# Altium project Task_2.PrjPcb (part 3 of 5)
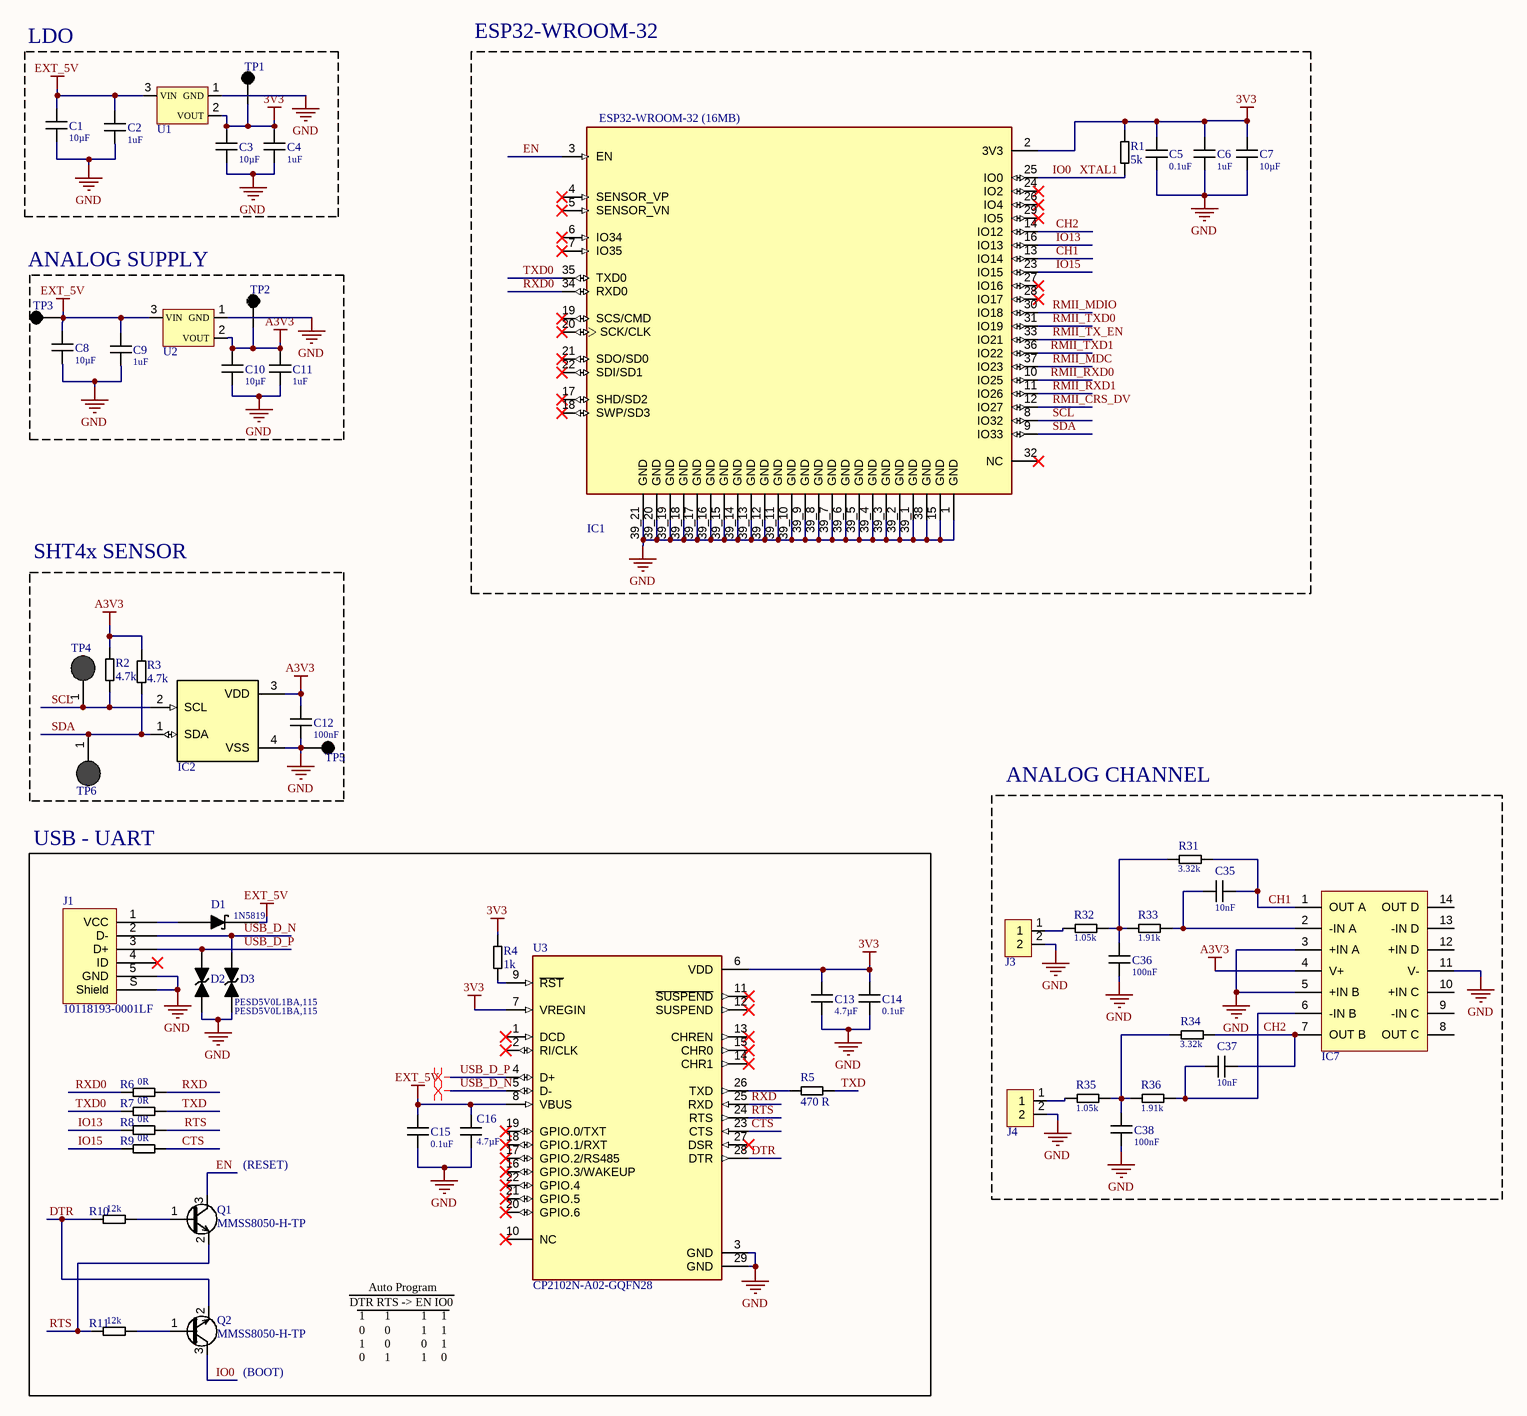
[diagram p3: Sheet1.SchDoc]

## Sheet Sheet1.SchDoc (continued)

### Library data of the parts (continued)
J3 J4 = T-Block 2 Pos: Series 1377 - 5.00 mm Horizontal Entry with Pressure Clamp WR-TBL, 2 pin; Manufacturer: Wurth Electronics; Plating: Copper Alloy,ZINC PLATED; Number of Levels: 1; Number of Positions Per Level: 2; Current: 16A; Voltage: 300V; Number of Contacts: 2NUMBER; Wire Gauge (Max): 30AWG; Wire Gauge (Min): 12AWG; Supplier: Digi-Key; Supplier Part Number: 732-10955-ND; Manufacturer Part Number: 691137710002; RoHS: Yes; Category: Terminal Blocks; Stock: 9094; Pricing: 1=0,41, 10=0,363, 50=0,32, 100=0,287, 500=0,277 (USD); Mounting Technology: Through Hole; Pins: 2NUMBER; Color: Green; Housing Material: PC; Contact Material: 153,154ConductorMaterial; Min Operating Temperature: -30°C; Max Operating Temperature: 120°C; Termination: Screw; Series: WR-TBL Series 1377; Current Rating: 16A; Number of Rows: 1NUMBER; Voltage Rating: 300V; Height: 11.6mm; Lead Pitch: 5mm; RoHS Compliant: Yes; ComponentLink1URL: https://katalog.we-online.de/em/datasheet/691137710002.pdf?src-supplier=Digi-Key; ComponentLink1Description: https://katalog.we-online.de/em/datasheet/691137710002.pdf?src-supplier=Digi-Key
Q1 Q2 = MMSS8050-H-TP: 25V 625mW 120@100mA, 1V 1.5A NPN SOT-23(TO-236) Bipolar Transistors - BJT ROHS; Manufacturer: MCC; Collector Base Voltage (VCBO): 40V; Collector Emitter Saturation Voltage: 500mV; Element Configuration: Single; Emitter Base Voltage (VEBO): 5V; Gain Bandwidth Product: 100MHz; hFE Min: 200; Max Power Dissipation: 300mW; Number of Elements: 1; Supplier 1: Farnell; Manufacturer Part Number: MMSS8050-H-TP; RoHS: Compliant; Category: BJTs; Stock 1: 5298; Pricing 1: 5=0,137, 10=0,081, 100=0,0507, 500=0,0361, 1000=0,0322, 5000=0,0254 (EUR); Case/Package: SOT-23; China RoHS: Compliant; Collector Emitter Breakdown Voltage: 25V; Collector Emitter Voltage (VCEO): 25V; Lead Free: Lead Free; Lifecycle Status: Production; Max Breakdown Voltage: 25V; Max Collector Current: 1.5A; Max Operating Temperature: 150°C; Min Operating Temperature: -55°C; Mount: Surface Mount; Number of Pins: 3; Number of Terminals: 3; Packaging: Tape & Reel (TR); Polarity: NPN; REACH SVHC: Yes; Schedule B: 8541210080, 8541210080|8541210080|8541210080|8541210080|8541210080|8541210080|8541210080|8541210080|8541210080|8541210080|8541210080|8541210080|8541210080|8541210080|8541210080|8541210080|8541210080|8541210080|8541210080|8541210080|8541210080|8541210080|8541210080|85; Transition Frequency: 100MHz; ComponentLink1URL: https://datasheet.octopart.com:443/MMSS8050-H-TP-MCC-datasheet-134701123.pdf?src-supplier=TME; ComponentLink1Description: https://datasheet.octopart.com:443/MMSS8050-H-TP-MCC-datasheet-134701123.pdf?src-supplier=TME; ComponentLink2URL: https://datasheet.octopart.com:443/MMSS8050-H-TP-MCC-datasheet-134581198.pdf?src-supplier=Future+Electronics; ComponentLink2Description: https://datasheet.octopart.com:443/MMSS8050-H-TP-MCC-datasheet-134581198.pdf?src-supplier=Future+Electronics; ComponentLink3URL: https://datasheet.octopart.com:443/MMSS8050-H-TP-MCC-datasheet-27626576.pdf?src-supplier=Future+Electronics; ComponentLink3Description: https://datasheet.octopart.com:443/MMSS8050-H-TP-MCC-datasheet-27626576.pdf?src-supplier=Future+Electronics; Supplier Part Number 1: 4627899
R1 = RES 5k OHM 0603: Res 5k Ohm %0.1 SMD 0603; Manufacturer: Yageo; Tolerance: 0.1%; Max Power Dissipation: 100mW; Temperature Coefficient: 50ppm/°C; Supplier: Digi-Key; Supplier Part Number: 13-RT0603BRE075KLCT-ND; Manufacturer Part Number: RT0603BRE075KL; RoHS: Yes; Category: Chip SMD Resistors; Stock: 19208; Pricing: 1=0,39, 10=0,278, 50=0,1514, 100=0,1111, 500=0,07566, 1000=0,05474 (USD); Case/Package: 0603; Min Operating Temperature: -55°C; Max Operating Temperature: 155°C; Packaging: Tape and Reel; Number of Terminations: 2; Series: RT; ComponentLink1URL: http://www.yageo.com/documents/recent/PYu-RT_1-to-0.01_RoHS_L_9.pdf?src-supplier=Digi-Key; ComponentLink1Description: http://www.yageo.com/documents/recent/PYu-RT_1-to-0.01_RoHS_L_9.pdf?src-supplier=Digi-Key
R2 R3 = RES 4.7k OHM 0805: SMD Chip Resistor, 4.7 kohm, ï¿½ 1%, 125 mW, 0805 [2012 Metric], Thick Film, General Purpose; Manufacturer: Vishay; Voltage Rating: 150V; Power Rating: 125mW; Temperature Coefficient: 100ppm/°C; Supplier 1: Farnell; Manufacturer Part Number: CRCW08054K70FKEA; RoHS: Yes; Category: Chip SMD Resistors; Stock 1: 597720; Pricing 1: 10=0,0285, 100=0,0199, 500=0,0155, 1000=0,0142, 2500=0,0132, 5000=0,0085 (EUR); Case/Package: 0805; Weight: 0.000194oz; Case Code (Imperial): 0805; Case Code (Metric): 2012; Contact Plating: Tin; Size Code: 0805; Min Operating Temperature: -55°C; Max Operating Temperature: 155°C; Tolerance: 1%; Packaging: Tape and Reel; Package Quantity: 10; Resistor Type: Thick Film; Number of Terminations: 2; Termination: SMD/SMT; Max Power Dissipation: 125mW; Voltage Rating (DC): 150V; Features: Automotive AEC-Q200; Series: CRCW; Resistance Tolerance: 1%; Technology: THICK FILM; Construction: Rectangular; Length: 2mm; Width: 0.049inch; Height: 0.45mm; Depth: 1.25mm; Radiation Hardening: No; Lead Free: Lead Free; Military Standard: Not; RoHS Compliant: Yes; Reach SVHC Compliant: Unknown; ComponentLink1URL: https://datasheet.ciiva.com/11808/0900766b80d98b26-11808992.pdf?src-supplier=Rs; ComponentLink1Description: https://datasheet.ciiva.com/11808/0900766b80d98b26-11808992.pdf?src-supplier=Rs; ComponentLink2URL: https://datasheet.ciiva.com/2467/dcrcwe3-2467438.pdf?src-supplier=Digikey; ComponentLink2Description: https://datasheet.ciiva.com/2467/dcrcwe3-2467438.pdf?src-supplier=Digikey; ComponentLink3URL: https://datasheet.ciiva.com/2467/dcrcwe3-2467439.pdf?src-supplier=Digikey; ComponentLink3Description: https://datasheet.ciiva.com/2467/dcrcwe3-2467439.pdf?src-supplier=Digikey; ComponentLink4URL: https://datasheet.ciiva.com/2467/dcrcwe3-2467437.pdf?src-supplier=Digikey; ComponentLink4Description: https://datasheet.ciiva.com/2467/dcrcwe3-2467437.pdf?src-supplier=Digikey; ComponentLink5URL: https://datasheet.ciiva.com/5550/dcrcwe3-109170-5550903.pdf?src-supplier=Mouser; ComponentLink5Description: https://datasheet.ciiva.com/5550/dcrcwe3-109170-5550903.pdf?src-supplier=Mouser; ComponentLink6URL: https://datasheet.ciiva.com/16213/dcrcwe3-16213733.pdf?src-supplier=Future+Electronics; ComponentLink6Description: https://datasheet.ciiva.com/16213/dcrcwe3-16213733.pdf?src-supplier=Future+Electronics; Supplier Part Number 1: 1469923
R4 = RES 1K OHM 0603: Res 1 kOhm, ±%1 SMD 0603; Manufacturer: Yageo; Tolerance: 1%; Temperature Coefficient: 100ppm/°C; Power Rating: 100mW; Voltage Rating: 50V; Supplier: Digi-Key; Supplier Part Number: 311-1.00KHRCT-ND; Manufacturer Part Number: RC0603FR-071KL; RoHS: Yes; Category: Chip SMD Resistors; Stock: 17822876; Pricing: 1=0,1, 10=0,019, 50=0,0112, 100=0,0093, 500=0,00622, 1000=0,00532 (USD); Case/Package: 0603; Contact Plating: Tin,Matte; Case Code (Imperial): 0603; Case Code (Metric): 1608; Min Operating Temperature: -55°C; Max Operating Temperature: 155°C; Resistor Type: Thick Film; Packaging: Tape and Reel; Termination: SMD/SMT; Features: Moisture Resistant; Series: RC; Max Power Dissipation: 100mW; Number of Terminations: 2; Technology: THICK FILM; Resistance Tolerance: 1%; Construction: Rectangular; Length: 1.6mm; Height: 0.45mm; Depth: 0.8mm; Reach SVHC Compliant: No; Lead Free: 5697LeadFree; Military Standard: Not; RoHS Compliant: Yes
R5 = RES 470 OHM 0603: Res 470 Ohm % 1 SMD 0603; Manufacturer: Yageo; Supplier: Digi-Key; Supplier Part Number: 13-RC0603FR-10470RLCT-ND; Manufacturer Part Number: RC0603FR-10470RL; RoHS: Yes; Category: Chip SMD Resistors; Stock: 60505; Pricing: 1=0,1, 10=0,018, 50=0,0106, 100=0,0088, 500=0,00592, 1000=0,00505, 5000=0,00363 (USD); ComponentLink1URL: https://datasheet.ciiva.com/12560/rc0603-272842-12560442.pdf?src-supplier=Mouser; ComponentLink1Description: https://datasheet.ciiva.com/12560/rc0603-272842-12560442.pdf?src-supplier=Mouser
R6-R9 = RES 0 OHM 0603: RES SMD 0 OHM JUMPER 1/10W 0603; Manufacturer: Yageo; Designed by: Semih AŞÇI; Tolerance: 1%; Power Rating: 100mW; Voltage Rating (DC): 50V; Temperature Coefficient: 200ppm/°C; Resistance Tolerance: 5%; Supplier 1: Digi-Key; Manufacturer Part Number: RC0603JR-070RL; RoHS: Yes; Category: Chip SMD Resistors; Stock 1: 2727203; Pricing 1: 5000=0,00224, 10000=0,00195, 25000=0,00171, 50000=0,00160 (USD); Case/Package: 0603; Number of Pins: 2; Contact Plating: Tin,Matte; Case Code (Imperial): 0603; Case Code (Metric): 1608; Size Code: 0603; Min Operating Temperature: -55°C; Max Operating Temperature: 155°C; Resistor Type: Thick Film; Packaging: Tape and Reel; Termination: SMD/SMT; Series: RC; Technology: THICK FILM; Package Quantity: 5000; Voltage Rating: 50V; Features: Moisture Resistant; Max Power Dissipation: 100mW; Number of Terminations: 2; Construction: Rectangular; Length: 1.6mm; Width: 0.8mm; Height: 0.45mm; Depth: 0.8mm; Radiation Hardening: No; REACH SVHC: No SVHC; Lead Free: Lead Free; RoHS Compliant: Yes; Military Standard: Not; Supplier Part Number 1: 311-0.0GRTR-ND
R10 R11 = RES 12k OHM 603: Res 12K Ohm %5 SMD 0603; Manufacturer: Yageo; Tolerance: 5%; Temperature Coefficient: 100ppm/°C; Voltage Rating (DC): 50V; Power Rating: 100mW; Supplier: Digi-Key; Supplier Part Number: 311-12KGRCT-ND; Manufacturer Part Number: RC0603JR-0712KL; RoHS: Yes; Category: Chip SMD Resistors; Stock: 414380; Pricing: 1=0,1, 10=0,014, 50=0,0088, 100=0,0073, 500=0,00486, 1000=0,00415 (USD); Case/Package: 0603; Pins: 2; Case Code (Metric): 1608; Case Code (Imperial): 0603; Min Operating Temperature: -55°C; Max Operating Temperature: 155°C; Resistor Type: Thick Film; Packaging: Tape and Reel; Voltage Rating: 50V; Package Quantity: 1; Number of Terminations: 2; Termination: SMD/SMT; Max Power Dissipation: 100mW; Features: Moisture Resistant; Series: RC; Resistance Tolerance: 5%; Length: 0.063inch; Width: 0.031inch; Height: 0.022inch; Reach SVHC Compliant: No; Lead Free: Lead Free; RoHS Compliant: Yes; ComponentLink1URL: https://datasheet.ciiva.com/2452/pyu-r-int-thick-7-2452913.pdf?src-supplier=Digi-Key; ComponentLink1Description: https://datasheet.ciiva.com/2452/pyu-r-int-thick-7-2452913.pdf?src-supplier=Digi-Key; ComponentLink2URL: https://datasheet.ciiva.com/2452/pyu-r-int-thick-7-2452911.pdf?src-supplier=Digi-Key; ComponentLink2Description: https://datasheet.ciiva.com/2452/pyu-r-int-thick-7-2452911.pdf?src-supplier=Digi-Key; ComponentLink3URL: https://datasheet.ciiva.com/2452/pyu-r-int-thick-7-2452912.pdf?src-supplier=Digi-Key; ComponentLink3Description: https://datasheet.ciiva.com/2452/pyu-r-int-thick-7-2452912.pdf?src-supplier=Digi-Key; ComponentLink4URL: https://datasheet.ciiva.com/7746/443971-7746437.pdf?src-supplier=Element14; ComponentLink4Description: https://datasheet.ciiva.com/7746/443971-7746437.pdf?src-supplier=Element14; ComponentLink5URL: https://datasheet.ciiva.com/7746/443971-7746438.pdf?src-supplier=Element14; ComponentLink5Description: https://datasheet.ciiva.com/7746/443971-7746438.pdf?src-supplier=Element14
R31 R34 = RES 3.32k OHM 0603: Res Thin Film 0603 3.32K Ohm 0.1% 0.1W(1/10W) ±25ppm/C Pad SMD Automotive T/R; Manufacturer: Panasonic; Manufacturer Part Number: ERA3AEB3321V; Max Power Dissipation: 100mW; Temperature Coefficient: 25ppm/°C; Voltage Rating: 75V; Supplier 1: Farnell; RoHS: Compliant; Category: Chip SMD Resistors; Stock 1: 5000; Pricing 1: 10=0,203, 100=0,169, 500=0,144, 1000=0,132, 2500=0,12, 5000=0,118 (EUR); Case/Package: 0603; Case Code (Imperial): 0603; Case Code (Metric): 1608; Composition: Metal Film, Thin Film; Contact Plating: Tin; Depth: 800µm; Features: Automotive AEC-Q200; Height: 450µm; Height - Seated (Max): 558.8µm; Lead Free: Lead Free; Length: 1.6mm; Lifecycle Status: Production; Max Operating Temperature: 155°C; Military Standard: Not; Min Operating Temperature: -55°C; Mount: Surface Mount; Number of Pins: 2; Number of Terminals: 2; Number of Terminations: 2; Packaging: Cut Tape; Power Dissipation: 100mW; Power Rating: 100mW; Radiation Hardening: No; REACH SVHC: Yes; Schedule B: 8533210045, 8533210045|8533210045|8533210045|8533210045|8533210045; Termination: SMD/SMT; Tolerance: 0.1%; Voltage Rating (DC): 75V; Width: 800µm; Working Voltage: 75V; ComponentLink1URL: https://datasheet.octopart.com:443/ERA3AEB3321V-Panasonic-datasheet-181959660.pdf?src-supplier=IHS; ComponentLink1Description: https://datasheet.octopart.com:443/ERA3AEB3321V-Panasonic-datasheet-181959660.pdf?src-supplier=IHS; ComponentLink2URL: https://datasheet.octopart.com:443/ERA3AEB3321V-Panasonic-datasheet-62287448.pdf?src-supplier=Newark; ComponentLink2Description: https://datasheet.octopart.com:443/ERA3AEB3321V-Panasonic-datasheet-62287448.pdf?src-supplier=Newark; ComponentLink3URL: https://datasheet.octopart.com:443/ERA3AEB3321V-Panasonic-datasheet-136531316.pdf?src-supplier=Newark; ComponentLink3Description: https://datasheet.octopart.com:443/ERA3AEB3321V-Panasonic-datasheet-136531316.pdf?src-supplier=Newark; ComponentLink4URL: https://datasheet.octopart.com:443/ERA3AEB3321V-Panasonic-datasheet-8367715.pdf?src-supplier=Newark; ComponentLink4Description: https://datasheet.octopart.com:443/ERA3AEB3321V-Panasonic-datasheet-8367715.pdf?src-supplier=Newark; ComponentLink5URL: https://datasheet.octopart.com:443/ERA-3AEB3321V-Panasonic-datasheet-154766165.pdf?src-supplier=Master+Electronics; ComponentLink5Description: https://datasheet.octopart.com:443/ERA-3AEB3321V-Panasonic-datasheet-154766165.pdf?src-supplier=Master+Electronics; ComponentLink6URL: https://datasheet.octopart.com:443/ERA3AEB3321V-Panasonic-datasheet-188913046.pdf?src-supplier=TME; ComponentLink6Description: https://datasheet.octopart.com:443/ERA3AEB3321V-Panasonic-datasheet-188913046.pdf?src-supplier=TME; ComponentLink7URL: https://sigma.octopart.com:443/150570796/technical_drawing/Panasonic-ERA3AEB3321V.pdf?src-supplier=Panasonic+SCT; ComponentLink7Description: https://sigma.octopart.com:443/150570796/technical_drawing/Panasonic-ERA3AEB3321V.pdf?src-supplier=Panasonic+SCT; ComponentLink8URL: https://datasheet.octopart.com:443/ERA3AEB3321V-Panasonic-datasheet-138783076.pdf?src-supplier=Burklin+Elektronik; ComponentLink8Description: https://datasheet.octopart.com:443/ERA3AEB3321V-Panasonic-datasheet-138783076.pdf?src-supplier=Burklin+Elektronik; ComponentLink9URL: https://datasheet.octopart.com/ERA3AEB3321V-Panasonic-datasheet-78375410.pdf; ComponentLink9Description: https://datasheet.octopart.com/ERA3AEB3321V-Panasonic-datasheet-78375410.pdf; ComponentLink10URL: https://datasheet.octopart.com:443/ERA-3AEB3321V-Panasonic-datasheet-62096640.pdf?src-supplier=Future+Electronics; ComponentLink10Description: https://datasheet.octopart.com:443/ERA-3AEB3321V-Panasonic-datasheet-62096640.pdf?src-supplier=Future+Electronics; ComponentLink11URL: https://datasheet.octopart.com:443/ERA3AEB3321V-Panasonic-datasheet-13266200.pdf?src-supplier=Electro+Sonic; ComponentLink11Description: https://datasheet.octopart.com:443/ERA3AEB3321V-Panasonic-datasheet-13266200.pdf?src-supplier=Electro+Sonic; ComponentLink12URL: https://datasheet.octopart.com:443/ERA3AEB3321V-Panasonic-datasheet-33006989.pdf?src-supplier=Electro+Sonic; ComponentLink12Description: https://datasheet.octopart.com:443/ERA3AEB3321V-Panasonic-datasheet-33006989.pdf?src-supplier=Electro+Sonic; ComponentLink13URL: https://datasheet.octopart.com:443/ERA-3AEB3321V-Panasonic-datasheet-46744048.pdf?src-supplier=Electro+Sonic; ComponentLink13Description: https://datasheet.octopart.com:443/ERA-3AEB3321V-Panasonic-datasheet-46744048.pdf?src-supplier=Electro+Sonic; Supplier Part Number 1: 4632580
R32 R35 = RES 1.05k OHM 0603: Res Thin Film 0603 1.05K Ohm 0.1% 0.1W(1/10W) ±25ppm/C Pad SMD Automotive T/R; Manufacturer: Panasonic; Manufacturer Part Number: ERA3AEB1051V; Max Power Dissipation: 100mW; Temperature Coefficient: 25ppm/°C; Voltage Rating: 75V; Supplier 1: Farnell; RoHS: Compliant; Category: Chip SMD Resistors; Stock 1: 4890; Pricing 1: 10=0,203, 100=0,169, 500=0,144, 1000=0,132, 2500=0,12, 5000=0,118 (EUR); Case/Package: 0603; Case Code (Imperial): 0603; Case Code (Metric): 1608; Composition: Metal Film, Thin Film; Contact Plating: Tin; Depth: 800µm; Features: Automotive AEC-Q200; Height: 450µm; Height - Seated (Max): 558.8µm; Lead Free: Lead Free; Length: 1.6mm; Lifecycle Status: Production; Max Operating Temperature: 155°C; Military Standard: Not; Min Operating Temperature: -55°C; Mount: Surface Mount; Number of Pins: 2; Number of Terminals: 2; Number of Terminations: 2; Power Dissipation: 100mW; Power Rating: 100mW; Radiation Hardening: No; REACH SVHC: Yes; Schedule B: 8533210045, 8533210045|8533210045|8533210045|8533210045|8533210045; Tolerance: 0.1%; Voltage Rating (DC): 75V; Width: 800µm; Working Voltage: 75V; ComponentLink1URL: https://datasheet.octopart.com:443/ERA3AEB1051V-Panasonic-datasheet-181959660.pdf?src-supplier=IHS; ComponentLink1Description: https://datasheet.octopart.com:443/ERA3AEB1051V-Panasonic-datasheet-181959660.pdf?src-supplier=IHS; ComponentLink2URL: https://datasheet.octopart.com:443/ERA3AEB1051V-Panasonic-datasheet-62287448.pdf?src-supplier=Future+Electronics; ComponentLink2Description: https://datasheet.octopart.com:443/ERA3AEB1051V-Panasonic-datasheet-62287448.pdf?src-supplier=Future+Electronics; ComponentLink3URL: https://datasheet.octopart.com:443/ERA3AEB1051V-Panasonic-datasheet-136531316.pdf?src-supplier=Newark; ComponentLink3Description: https://datasheet.octopart.com:443/ERA3AEB1051V-Panasonic-datasheet-136531316.pdf?src-supplier=Newark; ComponentLink4URL: https://datasheet.octopart.com:443/ERA3AEB1051V-Panasonic-datasheet-8367715.pdf?src-supplier=Newark; ComponentLink4Description: https://datasheet.octopart.com:443/ERA3AEB1051V-Panasonic-datasheet-8367715.pdf?src-supplier=Newark; ComponentLink5URL: https://datasheet.octopart.com:443/ERA-3AEB1051V-Panasonic-datasheet-154766165.pdf?src-supplier=JRH+Electronics; ComponentLink5Description: https://datasheet.octopart.com:443/ERA-3AEB1051V-Panasonic-datasheet-154766165.pdf?src-supplier=JRH+Electronics; ComponentLink6URL: https://datasheet.octopart.com:443/ERA3AEB1051V-Panasonic-datasheet-188913046.pdf?src-supplier=TME; ComponentLink6Description: https://datasheet.octopart.com:443/ERA3AEB1051V-Panasonic-datasheet-188913046.pdf?src-supplier=TME; ComponentLink7URL: https://sigma.octopart.com:443/150570796/technical_drawing/Panasonic-ERA3AEB1051V.pdf?src-supplier=Panasonic+SCT; ComponentLink7Description: https://sigma.octopart.com:443/150570796/technical_drawing/Panasonic-ERA3AEB1051V.pdf?src-supplier=Panasonic+SCT; ComponentLink8URL: https://datasheet.octopart.com:443/ERA3AEB1051V-Panasonic-datasheet-138783076.pdf?src-supplier=Burklin+Elektronik; ComponentLink8Description: https://datasheet.octopart.com:443/ERA3AEB1051V-Panasonic-datasheet-138783076.pdf?src-supplier=Burklin+Elektronik; ComponentLink9URL: https://datasheet.octopart.com/ERA3AEB1051V-Panasonic-datasheet-78375410.pdf; ComponentLink9Description: https://datasheet.octopart.com/ERA3AEB1051V-Panasonic-datasheet-78375410.pdf; ComponentLink10URL: https://datasheet.octopart.com:443/ERA3AEB1051V-Panasonic---ECG-datasheet-15994758.pdf?src-supplier=Farnell; ComponentLink10Description: https://datasheet.octopart.com:443/ERA3AEB1051V-Panasonic---ECG-datasheet-15994758.pdf?src-supplier=Farnell; ComponentLink11URL: https://datasheet.octopart.com:443/ERA3AEB1051V-Panasonic-datasheet-13266200.pdf?src-supplier=Electro+Sonic; ComponentLink11Description: https://datasheet.octopart.com:443/ERA3AEB1051V-Panasonic-datasheet-13266200.pdf?src-supplier=Electro+Sonic; ComponentLink12URL: https://datasheet.octopart.com:443/ERA-3AEB1051V-Panasonic-datasheet-33006989.pdf?src-supplier=Electro+Sonic; ComponentLink12Description: https://datasheet.octopart.com:443/ERA-3AEB1051V-Panasonic-datasheet-33006989.pdf?src-supplier=Electro+Sonic; ComponentLink13URL: https://datasheet.octopart.com:443/ERA-3AEB1051V-Panasonic-datasheet-46744048.pdf?src-supplier=Electro+Sonic; ComponentLink13Description: https://datasheet.octopart.com:443/ERA-3AEB1051V-Panasonic-datasheet-46744048.pdf?src-supplier=Electro+Sonic; Supplier Part Number 1: 4632600
R33 R36 = RES 1.91k OHM 0603: Res Thin Film 0603 1.91K Ohm 0.1% 0.1W(1/10W) ±25ppm/C Pad SMD Automotive T/R; Manufacturer: Panasonic; Max Power Dissipation: 100mW; Temperature Coefficient: 25ppm/°C; Voltage Rating: 75V; Supplier 1: Mouser; Manufacturer Part Number: ERA-3AEB1911V; RoHS: Compliant; Category: Chip SMD Resistors; Stock 1: 3131; Pricing 1: 1=0,1, 10=0,054, 50=0,054, 100=0,047, 1000=0,043, 10000=0,035 (USD); Case/Package: 0603; Case Code (Imperial): 0603; Case Code (Metric): 1608; Composition: Metal Film, Thin Film; Contact Plating: Tin; Depth: 800µm; Features: Automotive AEC-Q200; Height: 450µm; Lead Free: Lead Free; Length: 1.6mm; Lifecycle Status: Production; Max Operating Temperature: 155°C; Military Standard: Not; Min Operating Temperature: -55°C; Mount: Surface Mount; Number of Pins: 2; Number of Terminals: 2; Number of Terminations: 2; Power Dissipation: 100mW; Power Rating: 100mW; Radiation Hardening: No; REACH SVHC: Yes; Schedule B: 8533210045; Termination: SMD/SMT; Tolerance: 0.1%; Voltage Rating (DC): 75V; Width: 800µm; Working Voltage: 75V; ComponentLink1URL: https://datasheet.octopart.com:443/ERA-3AEB1911V-Panasonic-datasheet-62287448.pdf?src-supplier=element14+APAC; ComponentLink1Description: https://datasheet.octopart.com:443/ERA-3AEB1911V-Panasonic-datasheet-62287448.pdf?src-supplier=element14+APAC; ComponentLink2URL: https://datasheet.octopart.com:443/ERA3AEB1911V-Panasonic-datasheet-136531316.pdf?src-supplier=element14+APAC; ComponentLink2Description: https://datasheet.octopart.com:443/ERA3AEB1911V-Panasonic-datasheet-136531316.pdf?src-supplier=element14+APAC; ComponentLink3URL: https://datasheet.octopart.com:443/ERA-3AEB1911V-Panasonic-datasheet-8367715.pdf?src-supplier=RS+(Formerly+Allied+Electronics); ComponentLink3Description: https://datasheet.octopart.com:443/ERA-3AEB1911V-Panasonic-datasheet-8367715.pdf?src-supplier=RS+(Formerly+Allied+Electronics); ComponentLink4URL: https://datasheet.octopart.com:443/ERA-3AEB1911V-Panasonic-datasheet-154766165.pdf?src-supplier=Master+Electronics; ComponentLink4Description: https://datasheet.octopart.com:443/ERA-3AEB1911V-Panasonic-datasheet-154766165.pdf?src-supplier=Master+Electronics; ComponentLink5URL: https://datasheet.octopart.com:443/ERA-3AEB1911V-Panasonic-datasheet-13266200.pdf?src-supplier=Future+Electronics; ComponentLink5Description: https://datasheet.octopart.com:443/ERA-3AEB1911V-Panasonic-datasheet-13266200.pdf?src-supplier=Future+Electronics; ComponentLink6URL: https://datasheet.octopart.com:443/ERA-3AEB1911V-Panasonic-datasheet-12510007.pdf?src-supplier=Future+Electronics; ComponentLink6Description: https://datasheet.octopart.com:443/ERA-3AEB1911V-Panasonic-datasheet-12510007.pdf?src-supplier=Future+Electronics; ComponentLink7URL: https://datasheet.octopart.com:443/ERA-3AEB1911V-Panasonic-datasheet-11763931.pdf?src-supplier=Future+Electronics; ComponentLink7Description: https://datasheet.octopart.com:443/ERA-3AEB1911V-Panasonic-datasheet-11763931.pdf?src-supplier=Future+Electronics; ComponentLink8URL: https://datasheet.octopart.com:443/ERA-3AEB1911V-Panasonic-datasheet-10840895.pdf?src-supplier=Future+Electronics; ComponentLink8Description: https://datasheet.octopart.com:443/ERA-3AEB1911V-Panasonic-datasheet-10840895.pdf?src-supplier=Future+Electronics; ComponentLink9URL: https://datasheet.octopart.com:443/ERA-3AEB1911V-Panasonic-datasheet-5392808.pdf?src-supplier=Future+Electronics; ComponentLink9Description: https://datasheet.octopart.com:443/ERA-3AEB1911V-Panasonic-datasheet-5392808.pdf?src-supplier=Future+Electronics; ComponentLink10URL: https://datasheet.octopart.com:443/ERA-3AEB1911V-Panasonic-datasheet-61114971.pdf?src-supplier=Future+Electronics; ComponentLink10Description: https://datasheet.octopart.com:443/ERA-3AEB1911V-Panasonic-datasheet-61114971.pdf?src-supplier=Future+Electronics; ComponentLink11URL: https://datasheet.octopart.com:443/ERA3AEB1911V-Panasonic-datasheet-188913046.pdf?src-supplier=TME; ComponentLink11Description: https://datasheet.octopart.com:443/ERA3AEB1911V-Panasonic-datasheet-188913046.pdf?src-supplier=TME; ComponentLink12URL: https://datasheet.octopart.com:443/ERA-3AEB1911V-Panasonic-datasheet-182736486.pdf?src-supplier=JRH+Electronics; ComponentLink12Description: https://datasheet.octopart.com:443/ERA-3AEB1911V-Panasonic-datasheet-182736486.pdf?src-supplier=JRH+Electronics; ComponentLink13URL: https://sigma.octopart.com:443/150570796/technical_drawing/Panasonic-ERA3AEB1911V.pdf?src-supplier=Panasonic+SCT; ComponentLink13Description: https://sigma.octopart.com:443/150570796/technical_drawing/Panasonic-ERA3AEB1911V.pdf?src-supplier=Panasonic+SCT; ComponentLink14URL: https://datasheet.octopart.com:443/ERA3AEB1911V-Panasonic-datasheet-138783076.pdf?src-supplier=Burklin+Elektronik; ComponentLink14Description: https://datasheet.octopart.com:443/ERA3AEB1911V-Panasonic-datasheet-138783076.pdf?src-supplier=Burklin+Elektronik; ComponentLink15URL: https://datasheet.octopart.com/ERA-3AEB1911V-Panasonic-datasheet-78375410.pdf; ComponentLink15Description: https://datasheet.octopart.com/ERA-3AEB1911V-Panasonic-datasheet-78375410.pdf; Supplier Part Number 1: 667-ERA-3AEB1911V
TP1-TP3 TP5 = Test Point: MS27478 - Connectors Receptacle Electrical Solder Mounting Solder Type Hermetic Seal 38999 Series II; Manufacturer: Keystone; Manufacturer Part Number: 5007; Body Material: Bronze, PBT; Hole Diameter: 1.6mm; Inside Diameter: 1.78mm; Insulation: Insulated; Number of Contacts: 1; Outside Diameter: 3.18mm; Plating: Silver; Supplier 1: Farnell; RoHS: Compliant; Category: Connectors; Stock 1: 36826; Pricing 1: 1=0,124, 25=0,118, 50=0,112, 100=0,108, 500=0,103, 1000=0,099 (EUR); Color: White; Contact Material: Bronze; Contact Plating: Tin; Flammability Rating: UL94 V-0; Height: 8.89mm; Housing Color: White; Lead Free: Lead Free; Length: 8.89mm; Lifecycle Status: Production; Material: Bronze, Nylon, Silver; Mount: PCB, Through Hole; Number of Ports: 1; Orientation: Straight; Packaging: Bulk; REACH SVHC: Yes; ComponentLink1URL: https://datasheet.octopart.com:443/5007-Keystone-datasheet-15716159.pdf?src-supplier=IHS; ComponentLink1Description: https://datasheet.octopart.com:443/5007-Keystone-datasheet-15716159.pdf?src-supplier=IHS; ComponentLink2URL: https://datasheet.octopart.com:443/5007-Keystone-datasheet-23674.pdf?src-supplier=element14; ComponentLink2Description: https://datasheet.octopart.com:443/5007-Keystone-datasheet-23674.pdf?src-supplier=element14; ComponentLink3URL: https://datasheet.octopart.com:443/5007-Keystone-datasheet-60278094.pdf?src-supplier=LKR; ComponentLink3Description: https://datasheet.octopart.com:443/5007-Keystone-datasheet-60278094.pdf?src-supplier=LKR; ComponentLink4URL: https://datasheet.octopart.com:443/5007-Keystone-datasheet-9590016.pdf?src-supplier=Sager+Electronics; ComponentLink4Description: https://datasheet.octopart.com:443/5007-Keystone-datasheet-9590016.pdf?src-supplier=Sager+Electronics; ComponentLink5URL: https://datasheet.octopart.com:443/5007-Keystone-datasheet-10925273.pdf?src-supplier=RS+(Formerly+Allied+Electronics); ComponentLink5Description: https://datasheet.octopart.com:443/5007-Keystone-datasheet-10925273.pdf?src-supplier=RS+(Formerly+Allied+Electronics); ComponentLink6URL: https://datasheet.octopart.com:443/5007-Keystone-datasheet-6528.pdf?src-supplier=RS+(Formerly+Allied+Electronics); ComponentLink6Description: https://datasheet.octopart.com:443/5007-Keystone-datasheet-6528.pdf?src-supplier=RS+(Formerly+Allied+Electronics); ComponentLink7URL: https://datasheet.octopart.com:443/5007-Keystone-datasheet-549598.pdf?src-supplier=Future+Electronics; ComponentLink7Description: https://datasheet.octopart.com:443/5007-Keystone-datasheet-549598.pdf?src-supplier=Future+Electronics; ComponentLink8URL: https://datasheet.octopart.com:443/5007-Keystone-datasheet-527775.pdf?src-supplier=Future+Electronics; ComponentLink8Description: https://datasheet.octopart.com:443/5007-Keystone-datasheet-527775.pdf?src-supplier=Future+Electronics; Supplier Part Number 1: 2301285
U1 U2 = AMS1117-3.3V SMD: 3.3V Voltage regulator; Manufacturer: Advanced Monolithic Systems; Designed by: Semih AŞÇI; Manufacturer Part Number: AMS1117-3.3; RoHS Compliant: Yes
U3 = CP2102N-A02-GQFN28: 28-WFQFN Exposed Pad S-XQCC-N28 UART USB 2.0 interface controller 3V~3.6V 5mm 9.5mA 1.5MBps; Manufacturer: Silicon Labs; Manufacturer Lifecycle Status: FULL PRODUCTION; Max Junction Temperature (Tj): 105°C; Max Supply Voltage: 3.6V; Min Supply Voltage: 3V; Number of Digital IO: 7; Number of Ports: 1; Operating Supply Voltage: 3.3V; USB Standard: USB 2.0; Supplier 1: Arrow Electronics; Manufacturer Part Number: CP2102N-A02-GQFN28; RoHS: Compliant; Category: USB Interface ICs; Stock 1: 2256; Pricing 1: 1533=2,031 (USD); Ambient Temperature Range High: 85°C; China RoHS: Compliant; Data Rate: 1.5Mbps; Height: 800µm; Height - Seated (Max): 800µm; Interface: UART; Length: 5mm; Lifecycle Status: Production; Max Operating Temperature: 85°C; Min Operating Temperature: -40°C; Number of Terminals: 28; REACH SVHC: Yes; Terminal Pitch: 500µm; Width: 5mm; ComponentLink1URL: https://datasheet.octopart.com:443/CP2102N-A02-GQFN28-Silicon-Labs-datasheet-138898368.pdf?src-supplier=Augswan; ComponentLink1Description: https://datasheet.octopart.com:443/CP2102N-A02-GQFN28-Silicon-Labs-datasheet-138898368.pdf?src-supplier=Augswan; ComponentLink2URL: https://datasheet.octopart.com:443/CP2102N-A02-GQFN28-Silicon-Labs-datasheet-166051788.pdf?src-supplier=IHS; ComponentLink2Description: https://datasheet.octopart.com:443/CP2102N-A02-GQFN28-Silicon-Labs-datasheet-166051788.pdf?src-supplier=IHS; Supplier Part Number 1: CP2102N-A02-GQFN28

## Sheet ethernet.SchDoc
size 420 x 297 mm; SheetNumber: 2; SheetTotal: 2
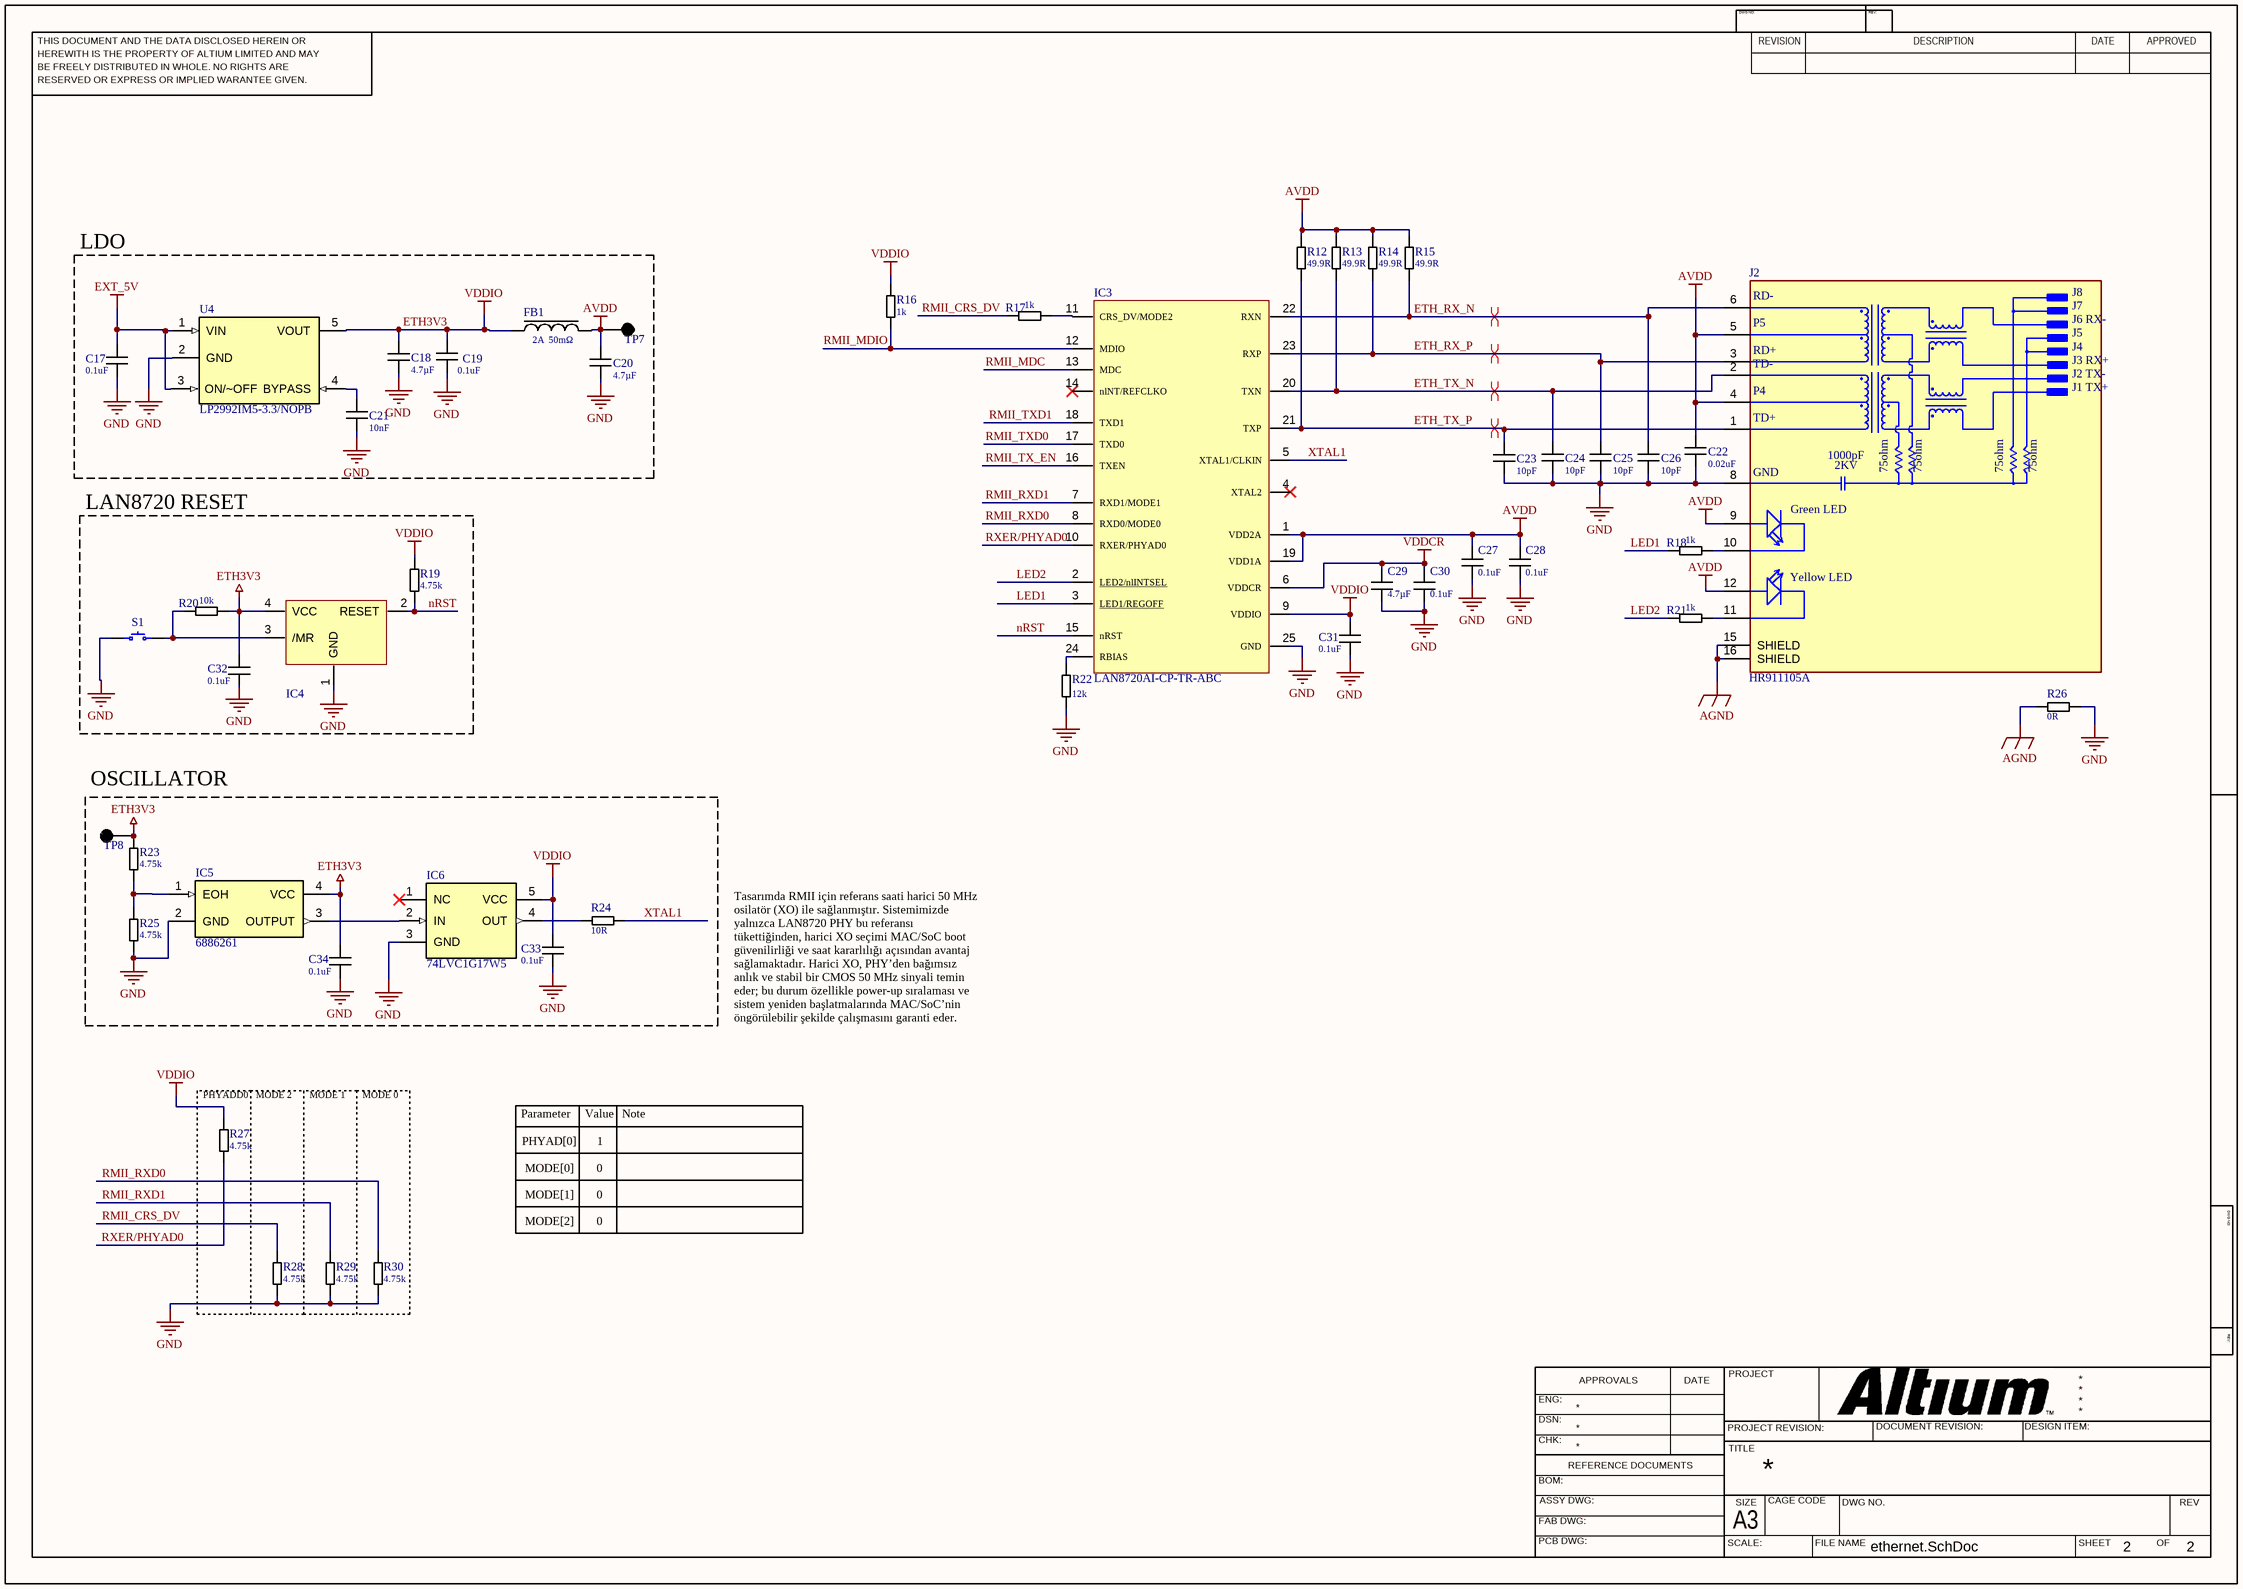
[diagram p1: ethernet.SchDoc]

### Parts
C17  Capacitance: 0.1uF  [CAP_0603]  (hidden comment: C0603C104K8RACTU)
C18  Capacitance: 4.7µF  [CAP_0603]  (hidden comment: CC0603KRX5R6BB475)
C19  Capacitance: 0.1uF  [CAP_0603]  (hidden comment: C0603C104K8RACTU)
C20  Capacitance: 4.7µF  [CAP_0603]  (hidden comment: CC0603KRX5R6BB475)
C21  Capacitance: 10nF  [CAP_0603]  (hidden comment: 06035C103MAZ2A)
C22  Capacitance: 0.02uF  [CAP_0603]  (hidden comment: KGM15AR71A223KT)
C23  Capacitance: 10pF  [CAP_0603]  (hidden comment: CC0603JRNPO9BN100)
C24  Capacitance: 10pF  [CAP_0603]  (hidden comment: CC0603JRNPO9BN100)
C25  Capacitance: 10pF  [CAP_0603]  (hidden comment: CC0603JRNPO9BN100)
C26  Capacitance: 10pF  [CAP_0603]  (hidden comment: CC0603JRNPO9BN100)
C27  Capacitance: 0.1uF  [CAP_0603]  (hidden comment: C0603C104K8RACTU)
C28  Capacitance: 0.1uF  [CAP_0603]  (hidden comment: C0603C104K8RACTU)
C29  Capacitance: 4.7µF  [CAP_0603]  (hidden comment: CC0603KRX5R6BB475)
C30  Capacitance: 0.1uF  [CAP_0603]  (hidden comment: C0603C104K8RACTU)
C31  Capacitance: 0.1uF  [CAP_0603]  (hidden comment: C0603C104K8RACTU)
C32  Capacitance: 0.1uF  [CAP_0603]  (hidden comment: C0603C104K8RACTU)
C33  Capacitance: 0.1uF  [CAP_0603]  (hidden comment: C0603C104K8RACTU)
C34  Capacitance: 0.1uF  [CAP_0603]  (hidden comment: C0603C104K8RACTU)
FB1  DC Resistance (DCR): 50mΩ  DC Current: 2A  [603_FB]  (hidden comment: BLM18PG121SN1D)
IC3  LAN8720AI-CP-TR-ABC  [QFN50P400X400X100-25N]
IC4  MIC6315-26D2UY-TR  [SOT190P237X118-4N]  (value not drawn)
IC5  Supplier Part Number 1: 6886261  [OSC_CB3LV-3I-50M000000]  (hidden comment: CB3LV-3I-50M000000)
IC6  74LVC1G17W5  [SOT95P280X145-5N]
J2  HR911105A  [HANRUN_HR911105A]
R12  Resistance: 49.9R  [RES_0603]  (hidden comment: ERJ-3EKF49R9V)
R13  Resistance: 49.9R  [RES_0603]  (hidden comment: ERJ-3EKF49R9V)
R14  Resistance: 49.9R  [RES_0603]  (hidden comment: ERJ-3EKF49R9V)
R15  Resistance: 49.9R  [RES_0603]  (hidden comment: ERJ-3EKF49R9V)
R16  value 1k  [RES_0603]  (hidden comment: RC0603FR-071KL)
R17  value 1k  [RES_0603]  (hidden comment: RC0603FR-071KL)
R18  value 1k  [RES_0603]  (hidden comment: RC0603FR-071KL)
R19  Resistance: 4.75k  [RES_0603]  (hidden comment: RC0603FR-074K75L)
R20  Resistance: 10k  [RES_0603]  (hidden comment: RC0603FR-0710KL)
R21  value 1k  [RES_0603]  (hidden comment: RC0603FR-071KL)
R22  value 12k  [RES_0603]  (hidden comment: RC0603JR-0712KL)
R23  Resistance: 4.75k  [RES_0603]  (hidden comment: RC0603FR-074K75L)
R24  Resistance: 10R  [RES_0603]  (hidden comment: RC0603JR-0710RL)
R25  Resistance: 4.75k  [RES_0603]  (hidden comment: RC0603FR-074K75L)
R26  Resistance: 0R  [RES_0603]  (hidden comment: RC0603JR-070RL)
R27  Resistance: 4.75k  [RES_0603]  (hidden comment: RC0603FR-074K75L)
R28  Resistance: 4.75k  [RES_0603]  (hidden comment: RC0603FR-074K75L)
R29  Resistance: 4.75k  [RES_0603]  (hidden comment: RC0603FR-074K75L)
R30  Resistance: 4.75k  [RES_0603]  (hidden comment: RC0603FR-074K75L)
S1  FSMSMTR  [TE FSMSMTR]  (value not drawn)
TP7  Test Point  [TP-5007]  (value not drawn)
TP8  Test Point  [TP-5007]  (value not drawn)
U4  LP2992IM5-3.3/NOPB  [SOT95P280X145-5N]

### Blocks framed on the sheet
LDO: C17-C21 FB1 TP7 U4
LAN8720 RESET: C32 IC4 R19 R20 S1
OSCILLATOR: C33 C34 IC5 IC6 R23-R25 TP8
PHYADD0: R27

### Nets
AGND: J2.15(SHIELD) J2.16(SHIELD) R26.1
AVDD: C20.2 C22.2 C27.2 C28.2 FB1.2 IC3.1(VDD2A) IC3.19(VDD1A) J2.4(P4) J2.5(P5) J2.9(GA) J2.12(YA) R12.2 R13.2 R14.2 R15.2 TP7.TP
ETH3V3: C18.2 C19.2 C31.2 C32.2 C33.2 C34.2 FB1.1 IC3.9(VDDIO) IC4.4(VCC) IC5.4(VCC) IC6.5(VCC) R16.1 R19.2 R20.2 R23.2 R27.2 TP8.TP U4.5(VOUT)  [also labelled VDDIO]
EXT_5V: C17.2 U4.1(VIN) U4.3(ON/~OFF)
GND: C17.1 C18.1 C19.1 C20.1 C21.1 C22.1 C23.1 C24.1 C25.1 C26.1 C27.1 C28.1 C29.1 C30.1 C31.1 C32.1 C33.1 C34.1 IC3.25(GND) IC4.1(GND) IC5.2(GND) IC6.3(GND) J2.8(GND) R22.1 R25.1 R26.2 R28.1 R29.1 R30.1 S1.1 U4.2(GND)
VDDCR: C29.2 C30.2 IC3.6(VDDCR)
ETH_RX_N: C26.2 IC3.22(RXN) J2.6(RD-) R15.1
ETH_RX_P: C25.2 IC3.23(RXP) J2.3(RD+) R14.1
ETH_TX_N: C24.2 IC3.20(TXN) J2.2(TD-) R13.1
ETH_TX_P: C23.2 IC3.21(TXP) J2.1(TD+) R12.1
LED1: IC3.3(LED1/REGOFF) R18.1
LED2: IC3.2(LED2/nlINTSEL) R21.1
nRST: IC3.15(nRST) IC4.2(RESET) R19.1
RMII_CRS_DV: R17.1 R28.2
RMII_MDC: IC3.13(MDC)
RMII_MDIO: IC3.12(MDIO) R16.2
RMII_RXD0: IC3.8(RXD0/MODE0) R30.2
RMII_RXD1: IC3.7(RXD1/MODE1) R29.2
RMII_TX_EN: IC3.16(TXEN)
RMII_TXD0: IC3.17(TXD0)
RMII_TXD1: IC3.18(TXD1)
RXER/PHYAD0: IC3.10(RXER/PHYAD0) R27.1
XTAL1: IC3.5(XTAL1/CLKIN) R24.2  [project net IO0]
NetC21_2: C21.2 U4.4(BYPASS)
NetIC3_11: IC3.11(CRS_DV/MODE2) R17.2
NetIC3_24: IC3.24(RBIAS) R22.2
NetIC4_3: IC4.3(/MR) R20.1 S1.2
NetIC5_1: IC5.1(EOH) R23.1 R25.2
NetIC5_3: IC5.3(OUTPUT) IC6.2(IN)
NetIC6_4: IC6.4(OUT) R24.1
NetJ2_10: J2.10(GC) R18.2
NetJ2_11: J2.11(YC) R21.2

Not connected (* = marked no-connect by the designer): IC3 4(XTAL2)* 14(nlNT/REFCLKO)*; IC6 1(NC)*

### Layout directives
differential pair: ETH_RX_N, ETH_RX_P, ETH_TX_N, ETH_TX_P

### Notes on the sheet
- Tasarımda RMII için referans saati harici 50 MHz osilatör (XO) ile sağlanmıştır. Sistemimizde yalnızca LAN8720 PHY bu referansı tükettiğinden, harici XO seçimi MAC/SoC boot güvenilirliği ve saat kararlılığı açısından avantaj sağlamaktadır. Harici XO, PHY’den bağımsız anlık ve stabil bir CMOS 50 MHz sinyali temin eder; bu durum özellikle power-up sıralaması ve sistem yeniden başlatmalarında MAC/SoC’nin öngörülebilir şekilde çalışmasını garanti eder.
- (near R27) MODE 2
- MODE 1
- MODE 0
- Parameter
- Value
- Note
- PHYAD[0]
- MODE[0]
- MODE[1]
- 0
- 1
- MODE[2]
- THIS DOCUMENT AND THE DATA DISCLOSED HEREIN OR
- HEREWITH IS THE PROPERTY OF ALTIUM LIMITED AND MAY
- DWG NO:
- REVISION
- REV:
- DESCRIPTION
- DATE
- APPROVED
- BE FREELY DISTRIBUTED IN WHOLE. NO RIGHTS ARE
- RESERVED OR EXPRESS OR IMPLIED WARANTEE GIVEN.
- ENG:
- APPROVALS
- PROJECT
- DSN:
- CHK:
- REFERENCE DOCUMENTS
- PROJECT REVISION:
- TITLE
- DOCUMENT REVISION:
- DESIGN ITEM:
- BOM:
- FAB DWG:
- PCB DWG:
- ASSY DWG:
- SCALE:
- A3
- SIZE
- CAGE CODE
- FILE NAME
- DWG NO.
- SHEET
- OF
- REV
- (in symbol HanRun - HR911105A) J8; J7; J6 RX-; J5; J4; J3 RX+; J2 TX-; J1 TX+; 1000pF; 2KV; 75ohm; Green LED; Yellow LED